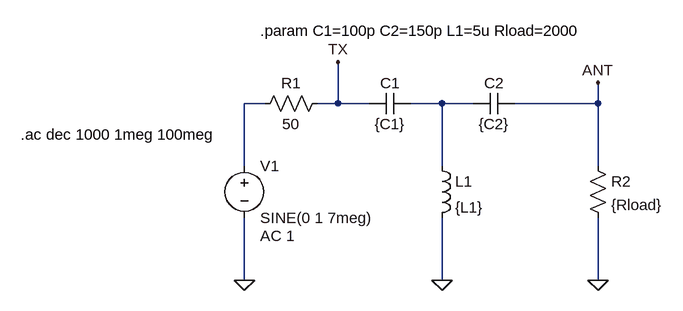
[diagram p0: schematic T_match.asc]
T_match.asc, the LTspice schematic file:
Version 4
SHEET 1 1004 680
WIRE 160 -16 128 -16
WIRE 272 -16 272 -80
WIRE 272 -16 240 -16
WIRE 320 -16 272 -16
WIRE 432 -16 384 -16
WIRE 480 -16 432 -16
WIRE 672 -16 672 -48
WIRE 672 -16 544 -16
WIRE 128 80 128 -16
WIRE 432 80 432 -16
WIRE 672 80 672 -16
WIRE 128 256 128 160
WIRE 432 256 432 160
WIRE 672 256 672 160
FLAG 128 256 0
FLAG 672 256 0
FLAG 432 256 0
FLAG 672 -48 ANT
FLAG 272 -80 TX
SYMBOL voltage 128 64 R0
WINDOW 123 24 124 Left 2
WINDOW 39 0 0 Left 0
SYMATTR InstName V1
SYMATTR Value SINE(0 1 7meg)
SYMATTR Value2 AC 1
SYMBOL res 256 -32 R90
WINDOW 0 0 56 VBottom 2
WINDOW 3 32 56 VTop 2
SYMATTR InstName R1
SYMATTR Value 50
SYMBOL cap 384 -32 R90
WINDOW 0 0 32 VBottom 2
WINDOW 3 32 32 VTop 2
SYMATTR InstName C1
SYMATTR Value {C1}
SYMBOL cap 544 -32 R90
WINDOW 0 0 32 VBottom 2
WINDOW 3 32 32 VTop 2
SYMATTR InstName C2
SYMATTR Value {C2}
SYMBOL res 656 64 R0
SYMATTR InstName R2
SYMATTR Value {Rload}
SYMBOL ind 416 64 R0
SYMATTR InstName L1
SYMATTR Value {L1}
TEXT 152 -128 Left 2 !.param C1=100p C2=150p L1=5u Rload=2000
TEXT -216 32 Left 2 !.ac dec 1000 1meg 100meg

The netlist it stands for:
* T_match.asc
V1 N001 0 SINE(0 1 7meg) AC 1
R1 TX N001 50
C1 N002 TX {C1}
C2 ANT N002 {C2}
R2 ANT 0 {Rload}
L1 N002 0 {L1}
.param C1=100p C2=150p L1=5u Rload=2000
.ac dec 1000 1meg 100meg
.backanno
.end